# EasyEDA Pro project ESP32-S3-WROOM-1 Breakout.epro

# Schematic ESP32-S3 DevBoard
Board Name: DevBoard; Create Date: 2026-04-19; Page Name: ESP32-S3-WROOM-1; Project Name: ESP32-S3-WROOM-1 Breakout; Schematic Name: ESP32-S3 DevBoard; Update Date: 2026-04-19; Company: EasyEDA.com; Page Size: A4; Version: V1.0
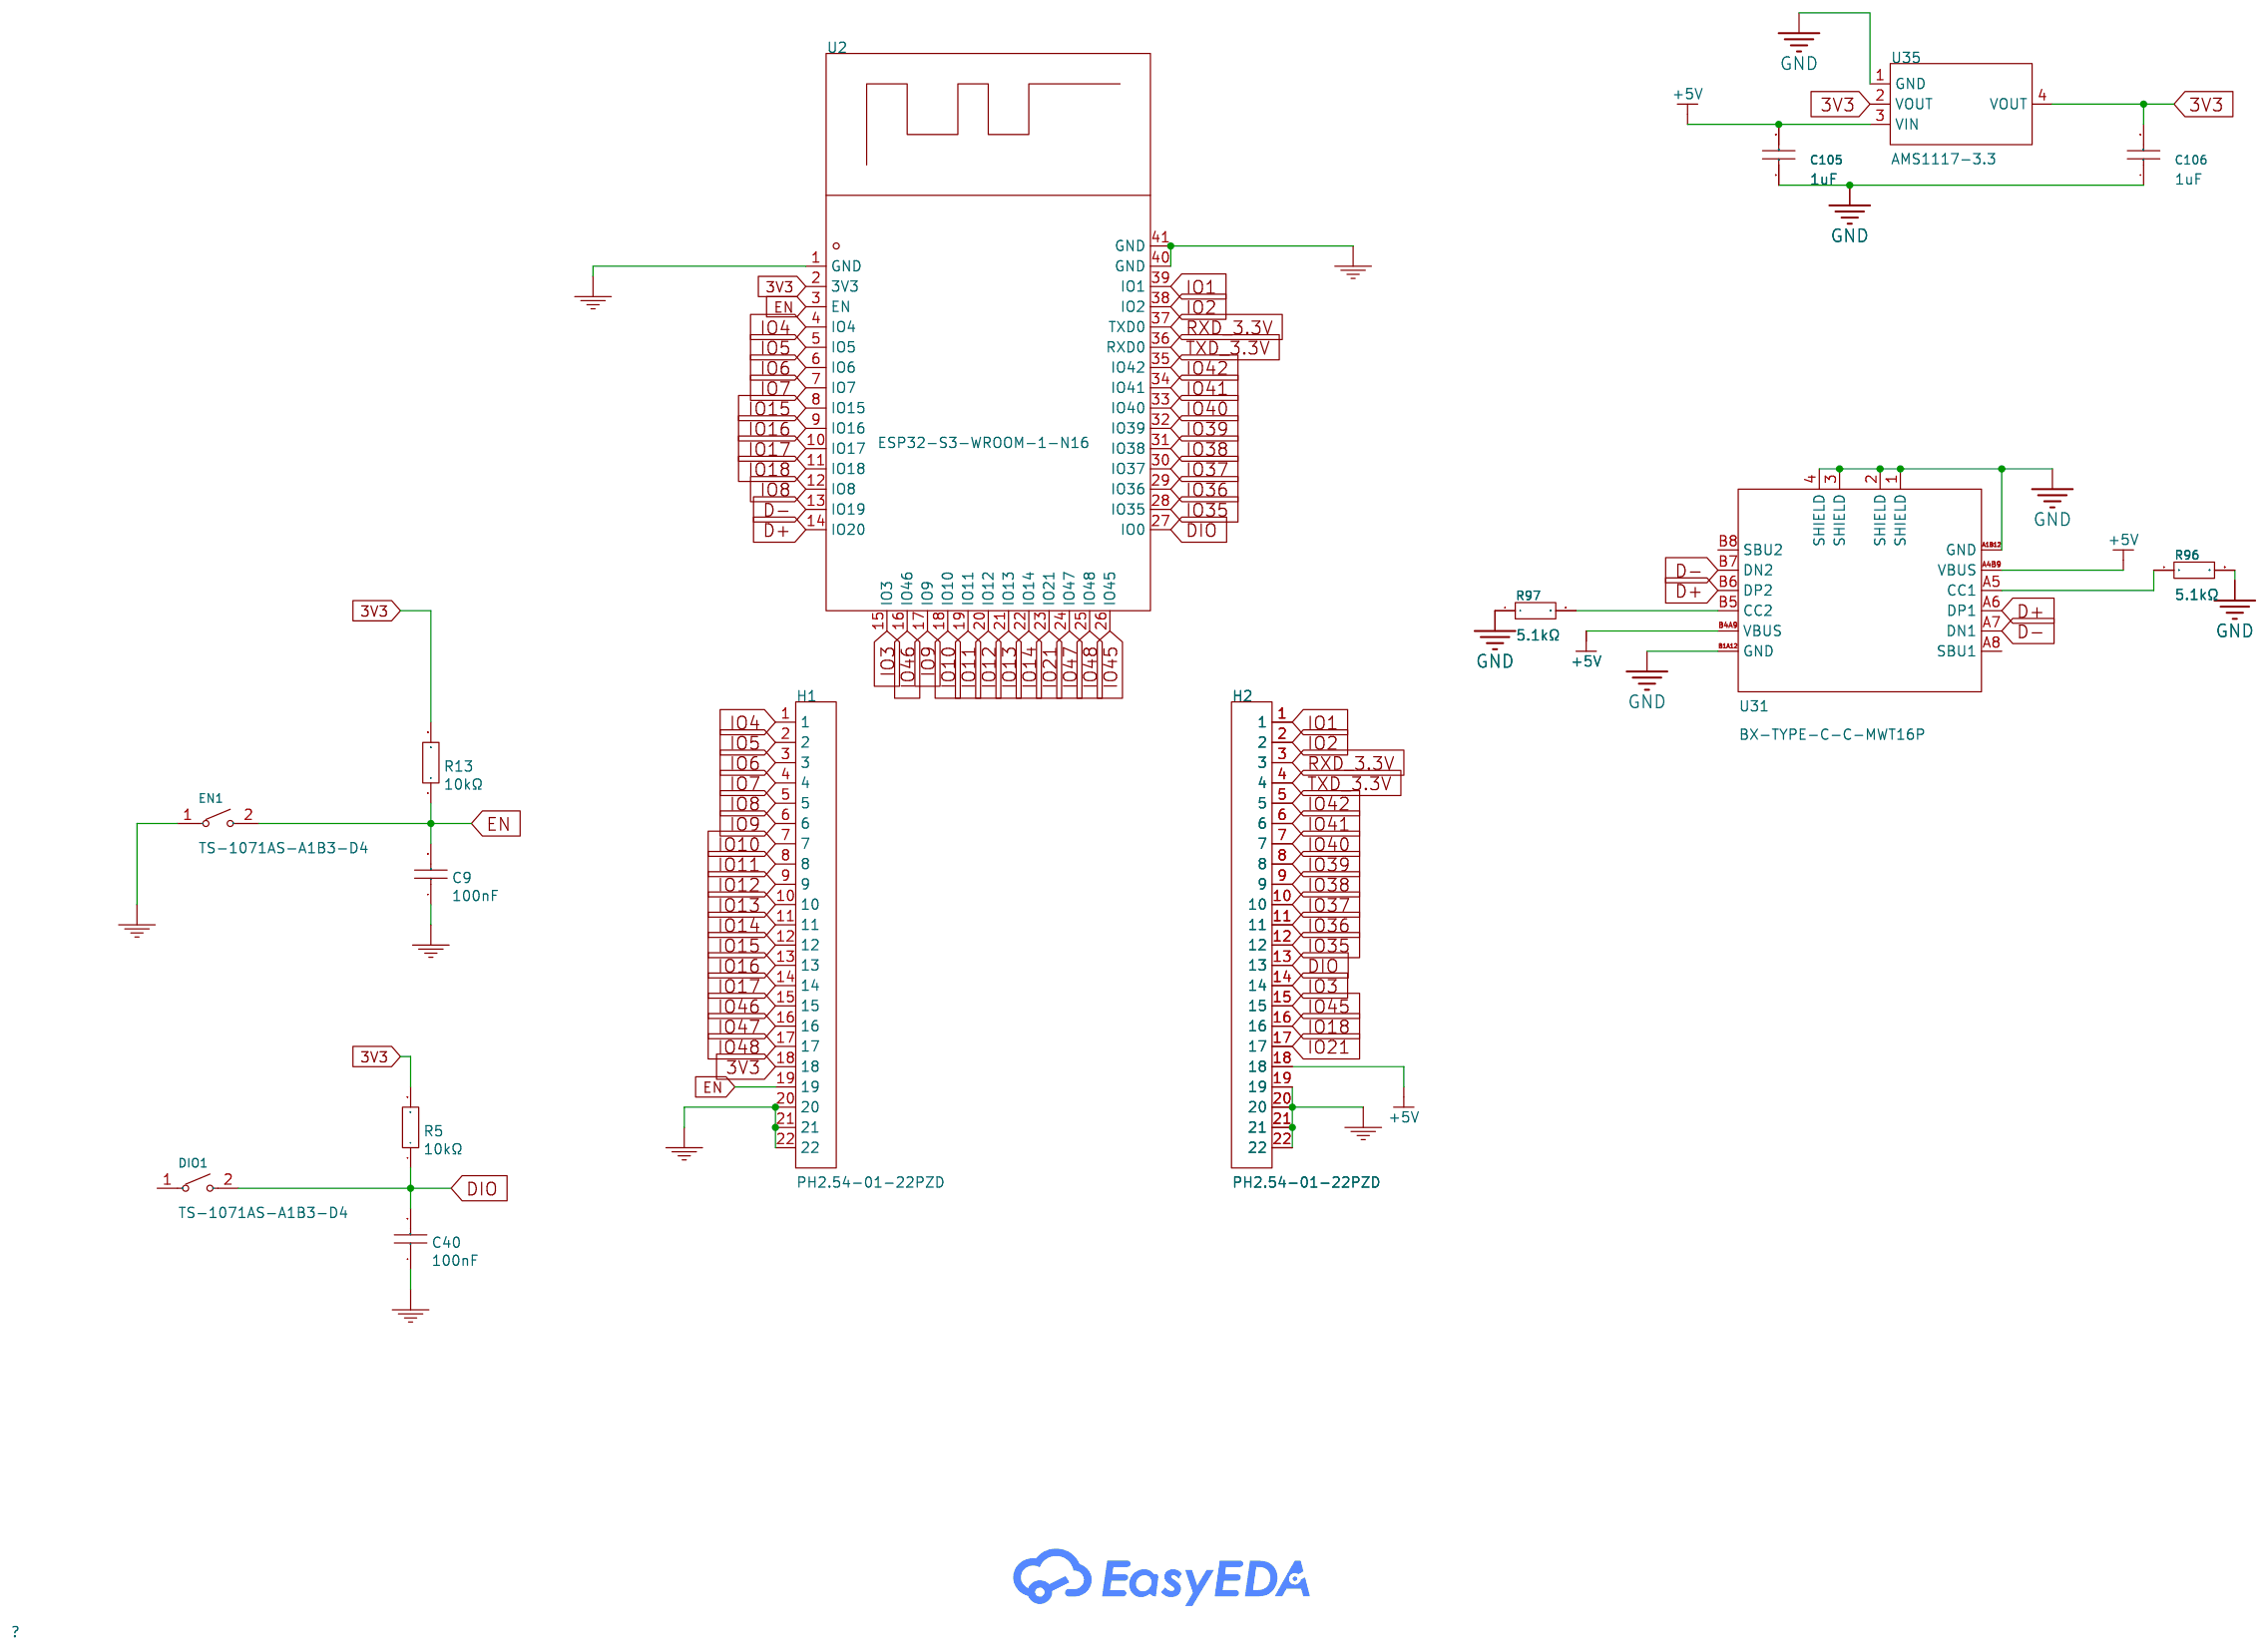
[diagram p0: schematic sheet]

## Parts
C9  100nF  [C0402_NEW]
C40  100nF  [C0402_NEW]
C105  1uF  [C0402]
C106  1uF  [C0402]
DIO1  TS-1071AS-A1B3-D4  [SW-SMD_L4.0-W3.0-LS4.8]
EN1  TS-1071AS-A1B3-D4  [SW-SMD_L4.0-W3.0-LS4.8]
H1  PH2.54-01-22PZD  [HDR-TH_PH2.54-01-22PZD]
H2  PH2.54-01-22PZD  [HDR-TH_PH2.54-01-22PZD]
R5  10kΩ  [R0402]
R13  10kΩ  [R0402]
R96  5.1kΩ  [R0402]
R97  5.1kΩ  [R0402]
U2  ESP32-S3-WROOM-1-N16  [WIRELM-SMD_ESP32-S3-WROOM-1]
U31  BX-TYPE-C-C-MWT16P  [USB-C-SMD_BX-TYPE-C-C-MWT16P]
U35  AMS1117-3.3  [SOT-223-3_L6.5-W3.4-P2.30-LS7.0-BR]

## Library data of the parts
C9 C40 = 100nF: Supplier: LCSC; Manufacturer Part: CL05B104KO5NNNC; Manufacturer: SAMSUNG; Supplier Part: C1525; JLCPCB Part Class: Basic Part
C105 C106 = CL05A105KP5NNNC: Capacitance: Tolerance:±10% Tolerance:±10% Voltage Rated: Temperature Coefficient:; LCSC Part Name: 1uF ±10% 10V; Supplier Part: C14445; Manufacturer: SAMSUNG(三星); Supplier Footprint: 0402; JLCPCB Part Class: Extended Part; Datasheet: https://atta.szlcsc.com/upload/public/pdf/source/20160218/1457707763339.pdf; Supplier: LCSC; Tolerance: ±10%
DIO1 EN1 = TS-1071AS-A1B3-D4: Circuit:SPST Actuator Style:Round Button Operating Force:250gf Mounting Style:Brick nogging Switch Length:4mm Switch Width:3mm Switch Height:2mm Actuator/Cap Color:Blue Pin Style:SMDSplicing Mechanical Life:-; LCSC Part Name: 4*3*2mm 立贴 轻触开关; Supplier Part: C492861; Manufacturer: Yuandi(元迪); Supplier Footprint: SMD; JLCPCB Part Class: Extended Part; Datasheet: https://atta.szlcsc.com/upload/public/pdf/source/20200427/C492861_8410BFD0129EF5D536AF148AD1D8A09B.pdf; Supplier: LCSC; Circuit: SPST; Actuator Style: Round Button; Operating Force: 250gf; Mounting Style: Brick nogging; Switch Length: 4mm; Switch Width: 3mm; Switch Height: 2mm; Actuator/Cap Color: Blue; Pin Style: SMDSplicing
H1 H2 = PH2.54-01-22PZD: Pin Structure:1x22P Pitch:2.54mm Circluar Pins/Square Pins:Pin Header Mounting Type:Through Hole Number of Rows:1 Number of Pins:22P Current Rating:3A Length of Mating Pin:6mm Insulation Height:2.5mm Contact Material:Brass Operating Temperature:-40℃~+105℃; LCSC Part Name: 1x22P 间距:2.54mm 方针 直插; Supplier Part: C53433113; Manufacturer: XUNPU(讯普); Supplier Footprint: 插件,P=2.54mm; JLCPCB Part Class: Extended Part; Datasheet: https://item.szlcsc.com/datasheet/PH2.54-01-22PZD/56574276.html; Supplier: LCSC; Pin Structure: 1x22P; Pitch: 2.54mm; Circluar Pins/Square Pins: Pin Header; Mounting Type: Through Hole; Number of Rows: 1; Number of Pins: 22P; Current Rating: 3A; Length of Mating Pin: 6mm; Insulation Height: 2.5mm; Contact Material: Brass; Operating Temperature: -40℃~+105℃
R5 R13 = 10kΩ: Supplier: LCSC; Manufacturer: UniOhm; Manufacturer Part: 0402WGF1002TCE; Supplier Part: C25744; Resistance: 10K; JLCPCB Part Class: Basic Part
R96 R97 = 0402WGF5101TCE: Type:Thick Film Resistor Resistance:5.1kΩ Tolerance:±1% Tolerance:±1% Power(Watts):62.5mW Voltage-Supply(Max):50V Temperature Coefficient:±100ppm/℃ Temperature Coefficient:±100ppm/℃ Operating Temperature:-55℃~+155℃ Operating Temperature:-55℃~+155℃; LCSC Part Name: 5.1kΩ ±1% 62.5mW 厚膜电阻; Supplier Part: C25905; Manufacturer: UNI-ROYAL(厚声); Supplier Footprint: 0402; Datasheet: https://item.szlcsc.com/datasheet/0402WGF5101TCE/26648.html; Supplier: LCSC; Type: Thick Film Resistor; Tolerance: ±1%; Power(Watts): 62.5mW; Voltage-Supply(Max): 50V; Temperature Coefficient: ±100ppm/℃; Operating Temperature: -55℃~+155℃
U2 = ESP32-S3-WROOM-1-N16: LCSC Part Name: 通用型Wi-Fi+低功耗蓝牙MCU模组; Supplier Part: C2913199; Manufacturer: ESPRESSIF(乐鑫); Supplier Footprint: SMD,18x25.5mm; JLCPCB Part Class: Extended Part; Datasheet: https://atta.szlcsc.com/upload/public/pdf/source/20241030/6A412B13087E1327DF6279F5735253CA.pdf; Supplier: LCSC
U31 = BX-TYPE-C-C-MWT16P: Connector Type:Type-C Standard:USB 3.1 Gender:Mother Mounting Style:Horizontal attachment Number of Contacts:16P Number of Ports:1 Current Rating - Power (Max):5A Operating Temperature Range:-45℃~+85℃ Operating Temperature Range:-45℃~+85℃; LCSC Part Name: Type-C 母 卧贴; Supplier Part: C18077665; Manufacturer: Bossie(博锡); Supplier Footprint: SMD; JLCPCB Part Class: Extended Part; Datasheet: https://atta.szlcsc.com/upload/public/pdf/source/20231017/F39B3F898DD8D16D3D2CEE0BEEB24AE0.pdf; Supplier: LCSC; Connector Type: Type-C; Standard: USB 3.1; Gender: Mother; Mounting Style: Horizontal attachment; Number of Contacts: 16P; Number of Ports: 1; Current Rating - Power (Max): 5A; Operating Temperature Range: -45℃~+85℃
U35 = AMS1117-3.3_C6186: Output Type:Fixed Voltage - Supply:16V Output Voltage:3.3V Output Voltage:3.3V Output Current:1A Power Supply Rejection Ratio (PSRR):72dB@(120Hz) Voltage Dropout:1.1V@(800mA) standby current:5mA Noise:0.003%Vout Features:Over Current Protection；Over Tempe; LCSC Part Name: 输出3.3V 1A; Supplier Part: C6186; Manufacturer: AMS; Supplier Footprint: SOT-223; JLCPCB Part Class: Basic Part; Datasheet: https://item.szlcsc.com/datasheet/AMS1117-3.3/6652.html; Supplier: LCSC; Output Type: Fixed; Voltage - Supply: 16V; Output Voltage: 3.3V; Output Current: 1A; Power Supply Rejection Ratio (PSRR): 72dB@(120Hz); Voltage Dropout: 1.1V@(800mA); standby current: 5mA; Noise: 0.003%Vout; Features: Over Current Protection；Over Temperature Protection; Operating Temperature: -40℃~+125℃; Output Configuration: Positive; Number of Outputs: 1

## Nets
3V3: C106.2 H1.18 R5.2 R13.2 U2.2(3V3) U35.2(VOUT) U35.4(VOUT)
+5V: C105.2 H2.18 U31.A4B9(VBUS) U31.B4A9(VBUS) U35.3(VIN)
GND: C9.1 C40.1 C105.1 C106.1 EN1.1 H1.20 H1.21 H1.22 H2.19 H2.20 H2.21 H2.22 R96.2 R97.1 U2.1(GND) U2.40(GND) U2.41(GND) U31.1(SHIELD) U31.2(SHIELD) U31.3(SHIELD) U31.4(SHIELD) U31.A1B12(GND) U31.B1A12(GND) U35.1(GND)
D+: U2.14(IO20) U31.A6(DP1) U31.B6(DP2)
D-: U2.13(IO19) U31.A7(DN1) U31.B7(DN2)
DIO: C40.2 DIO1.2 H2.13 R5.1 U2.27(IO0)
EN: C9.2 EN1.2 H1.19 R13.1 U2.3(EN)
IO1: H2.1 U2.39(IO1)
IO2: H2.2 U2.38(IO2)
IO3: H2.14 U2.15(IO3)
IO4: H1.1 U2.4(IO4)
IO5: H1.2 U2.5(IO5)
IO6: H1.3 U2.6(IO6)
IO7: H1.4 U2.7(IO7)
IO8: H1.5 U2.12(IO8)
IO9: H1.6 U2.17(IO9)
IO10: H1.7 U2.18(IO10)
IO11: H1.8 U2.19(IO11)
IO12: H1.9 U2.20(IO12)
IO13: H1.10 U2.21(IO13)
IO14: H1.11 U2.22(IO14)
IO15: H1.12 U2.8(IO15)
IO16: H1.13 U2.9(IO16)
IO17: H1.14 U2.10(IO17)
IO18: H2.16 U2.11(IO18)
IO21: H2.17 U2.23(IO21)
IO35: H2.12 U2.28(IO35)
IO36: H2.11 U2.29(IO36)
IO37: H2.10 U2.30(IO37)
IO38: H2.9 U2.31(IO38)
IO39: H2.8 U2.32(IO39)
IO40: H2.7 U2.33(IO40)
IO41: H2.6 U2.34(IO41)
IO42: H2.5 U2.35(IO42)
IO45: H2.15 U2.26(IO45)
IO46: H1.15 U2.16(IO46)
IO47: H1.16 U2.24(IO47)
IO48: H1.17 U2.25(IO48)
RXD_3.3V: H2.3 U2.37(TXD0)
TXD_3.3V: H2.4 U2.36(RXD0)
$1N1378: R96.1 U31.A5(CC1)
$1N1381: R97.2 U31.B5(CC2)

Not connected (* = marked no-connect by the designer): DIO1 1; U31 A8(SBU1) B8(SBU2)

# Board ESP32-S3-WROOM-1
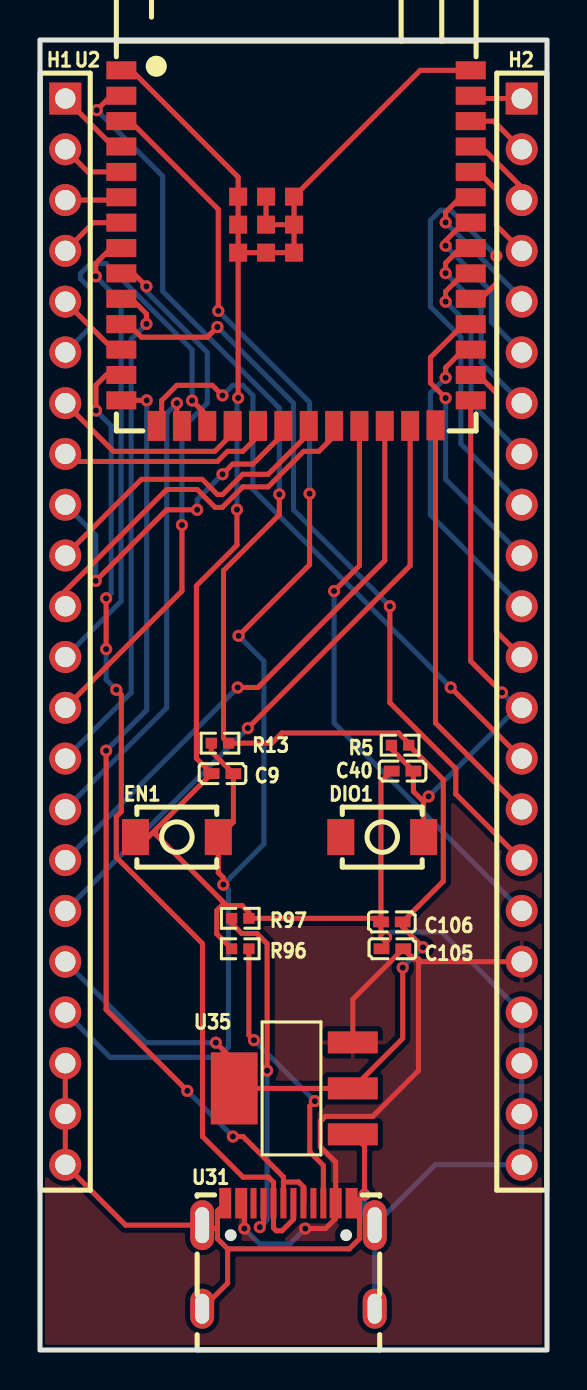
[diagram p1: board, top side]
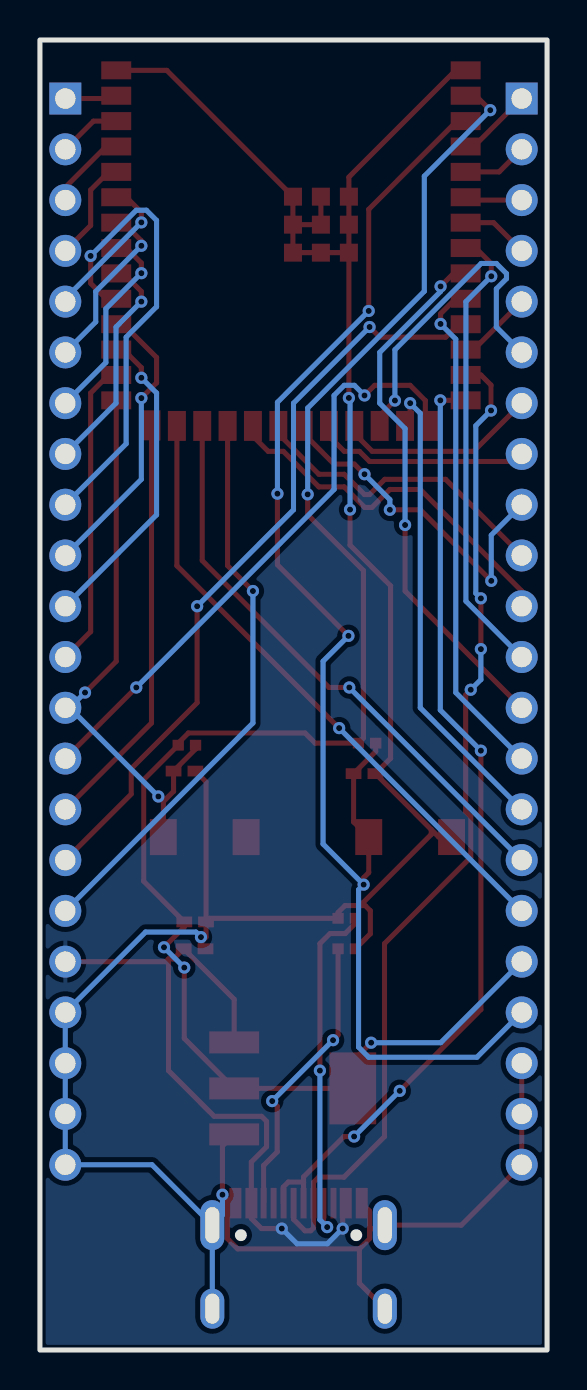
[diagram p2: board, bottom side, seen from below]

Outline 25.4 x 65.54 mm; copper layers: Top Layer, Bottom Layer. Coordinates in mm from the lower left corner of the outline.
Outline path: rectangle 0,65.54 25.4,0
Stack: Top Layer 0.035mm / Dielectric1 1.51mm FR4 er 4.5 / Bottom Layer 0.035mm

## Design rules (mm)
template: JLCPCB Capability(Two Layers Board)
spacing copperThickness1oz (default): track to track 0.102, other pairs 0.152 to 0.3
spacing copperThickness2oz: track to track 0.203, other pairs 0.152 to 0.3
track width copperThickness1oz (default): min 0.127, default 0.254, max 2.54
track width copperThickness2oz: min 0.203, default 0.254, max 2.54
differential pair differentialPair (default): width min 0.127, default 0.254, max 2.54; gap min 0.152, default 0.152
via viaSize (default): diameter min 0.5, default 0.61, max 10; hole min 0.3, default 0.305, max 6.3

## Placement (name value [footprint] x y rotation side)
C9  100nF  [C0402_NEW]  9.14 28.84 0 top
C40  100nF  [C0402_NEW]  18.16 28.96 0 top
C105  1uF  [C0402]  17.65 20.07 0 top
C106  1uF  [C0402]  17.63 21.42 0 top
DIO1  TS-1071AS-A1B3-D4  [SW-SMD_L4.0-W3.0-LS4.8]  17.14 25.66 0 top
EN1  TS-1071AS-A1B3-D4  [SW-SMD_L4.0-W3.0-LS4.8]  6.86 25.66 0 top
H1  PH2.54-01-22PZD  [HDR-TH_PH2.54-01-22PZD]  1.27 35.94 270 top
H2  PH2.54-01-22PZD  [HDR-TH_PH2.54-01-22PZD]  24.13 35.94 270 top
R5  10kΩ  [R0402]  18.04 30.26 0 top
R13  10kΩ  [R0402]  9.02 30.36 0 top
R96  5.1kΩ  [R0402]  10.03 21.6 0 top
R97  5.1kΩ  [R0402]  10.03 20.07 0 top
U2  ESP32-S3-WROOM-1-N16  [WIRELM-SMD_ESP32-S3-WROOM-1]  12.83 55.13 0 top
U31  BX-TYPE-C-C-MWT16P  [USB-C-SMD_BX-TYPE-C-C-MWT16P]  12.45 4.71 0 top
U35  AMS1117-3.3  [SOT-223-3_L6.5-W3.4-P2.30-LS7.0-BR]  12.7 13.09 0 top

## Footprints (pads in the part's own frame, mm; a bottom-side part is the same pattern mirrored in y, then rotated)
C0402
  rect 0.79x0.54 smd: 1(-0.545,0) 2(0.545,0)
C0402_NEW
  rect 0.79x0.54 smd: 1(-0.545,0) 2(0.545,0)
HDR-TH_PH2.54-01-22PZD
  rect 1.6x1.6 hole 1.02: 1(-26.67,0)
  round 1.6 hole 1.02: 2(-24.13,0) 3(-21.59,0) 4(-19.05,0) 5(-16.51,0) 6(-13.97,0) 7(-11.43,0) 8(-8.89,0) 9(-6.35,0) 10(-3.81,0) 11(-1.27,0) 12(1.27,0) 13(3.81,0) 14(6.35,0) 15(8.89,0) 16(11.43,0) 17(13.97,0) 18(16.51,0) 19(19.05,0) 20(21.59,0) 21(24.13,0) 22(26.67,0)
R0402
  rect 0.566x0.54 smd: 1(-0.433,0) 2(0.433,0)
SOT-223-3_L6.5-W3.4-P2.30-LS7.0-BR
  rect 2.5x1.1 smd: 1(2.97,-2.3) 2(2.97,0) 3(2.97,2.3)
  rect 2.34x3.6 smd: 4(-2.97,0)
SW-SMD_L4.0-W3.0-LS4.8
  rect 1.35x1.8 smd: 1(-2.075,0) 2(2.075,0)
USB-C-SMD_BX-TYPE-C-C-MWT16P
  oval 1.2x2.5 hole 0.7x1.8: 1(-4.32,1.54) 3(4.32,1.54)
  oval 1.2x2 hole 0.7x1.5: 2(-4.32,-2.64) 4(4.32,-2.64)
  rect 0.6x1.524 smd: A1B12(-3.165,2.64) A4B9(-2.365,2.64) B1A12(3.165,2.64) B4A9(2.365,2.64)
  rect 0.3x1.524 smd: A5(-1.25,2.64) A6(-0.25,2.64) A7(0.25,2.64) A8(1.25,2.64) B5(1.75,2.64) B6(0.75,2.64) B7(-0.75,2.64) B8(-1.75,2.64)
WIRELM-SMD_ESP32-S3-WROOM-1
  rect 1.5x0.9 smd: 1(-8.75,8.895) 2(-8.75,7.625) 3(-8.75,6.355) 4(-8.75,5.085) 5(-8.75,3.815) 6(-8.75,2.545) 7(-8.75,1.275) 8(-8.75,0.005) 9(-8.75,-1.265) 10(-8.75,-2.535) 11(-8.75,-3.805) 12(-8.75,-5.075) 13(-8.75,-6.345) 14(-8.75,-7.615) 27(8.75,-7.615) 28(8.75,-6.345) 29(8.75,-5.075) 30(8.75,-3.805) 31(8.75,-2.535) 32(8.75,-1.265) 33(8.75,0.005) 34(8.75,1.275) 35(8.75,2.545) 36(8.75,3.815) 37(8.75,5.085) 38(8.75,6.355) 39(8.75,7.625) 40(8.75,8.895)
  rect 0.9x1.5 smd: 15(-6.985,-8.895) 16(-5.715,-8.895) 17(-4.445,-8.895) 18(-3.175,-8.895) 19(-1.905,-8.895) 20(-0.635,-8.895) 21(0.635,-8.895) 22(1.905,-8.895) 23(3.175,-8.895) 24(4.445,-8.895) 25(5.715,-8.895) 26(6.985,-8.865)
  rect 0.9x0.9 smd: 41(-2.9,2.575) 41(-2.9,1.175) 41(-2.9,-0.225) 41(-1.5,2.575) 41(-1.5,1.175) 41(-1.5,-0.225) 41(-0.1,2.575) 41(-0.1,1.175) 41(-0.1,-0.225)

## Nets
As in the schematic.

Pads without a net: DIO1 1; U31 A8 B8

## Via types
v1: diameter 0.61, hole 0.305, Top Layer to Bottom Layer, 52 vias

## Routing (per net, layer and track width the routed paths; a pad name or vN(x,y) marks a point on that pad's centre or on a via; arc(x,y) is an arc through that point)
3V3: length 86.3
  Top Layer w0.254: 9.83,13.09 U35.2 18.17,15.59 v1(18.17,19.13) ; 9.83,13.09 U35.4 ; 9.83,13.09 9.83,14.36 v1(8.81,15.38) ; U2.2 3.57,62.75 v1(2.85,62.03) ; v1(11.99,42.81) 11.99,41.79 9.2,39 9.2,30.61 R13.2 11.61,30.36 12.12,30.87 17.96,30.87 18.47,30.36 18.47,30.26 20.2,28.53 20.2,23.45 C106.2 18.17,21.16 v1(19.19,20.15)
  Bottom Layer w0.254: v1(11.99,42.81) 11.99,47.12 6.15,52.97 6.15,58.73 v1(2.85,62.03) ; v1(8.81,15.38) 5.32,15.38 H1.18 ; v1(19.19,20.15) v1(18.17,19.13)
+5V: length 35.4
  Top Layer w0.254: 18.96,19.57 18.71,19.57 C105.2 15.67,17.55 U35.3 ; 18.96,19.57 19.1,19.43 H2.18 ; 18.96,19.57 18.96,13.98 16.67,11.69 14.3,11.69 14.05,11.44 14.05,10.17 14.81,9.41 14.81,6.59 14.3,6.08 v1(13.29,6.08) ; v1(10.24,6.08) 10.24,7.19 U31.A4B9
  Bottom Layer w0.254: v1(13.29,6.08) 12.52,5.31 11,5.31 v1(10.24,6.08)
GND: length 153.8
  Top Layer w0.254: U2.40 19.05,64.02 12.73,57.7 12.73,56.3 ; C106.1 16.9,21.6 R96.2 10.47,21.89 10.12,22.23 9.36,22.23 ; C106.1 17.08,20.66 17.33,20.4 ; C106.1 17.08,28.43 C40.1 ; 12.73,56.3 12.73,54.9 U2.41 U2.41 ; 12.73,56.3 U2.41 U2.41 ; 17.33,20.4 v1(17.33,20.66) ; 17.33,20.4 17.33,20.3 C105.1 ; U2.41 U2.41 U2.41 9.93,58.68 4.59,64.01 4.08,64.01 U2.1 ; U2.41 v1(9.93,47.63) ; 5.8,26.04 C9.1 7.84,29.6 7.84,38.23 9.87,40.27 v1(9.87,42.04) ; 5.8,26.04 5.8,25.79 9.36,22.23 ; 5.8,26.04 5.42,25.66 EN1.1 ; 9.36,22.23 9.11,22.23 8.85,21.98 8.85,20.82 R97.1 ; 16,7.52 15.78,7.52 U31.B1A12 ; 16,7.52 16,5.57 15.5,5.06 9.4,5.06 ; 16,7.52 v1(16.26,7.77) 16.26,10.2 U35.1 ; 8.89,6.08 8.3,6.08 U31.1 4.29,6.25 1.27,9.27 H1.21 H1.20 ; 8.89,6.08 8.89,5.57 9.4,5.06 ; 8.89,6.08 8.89,6.96 U31.A1B12 ; 9.4,5.06 9.4,3.34 U31.2
  Bottom Layer w0.254: v1(9.93,47.63) 9.87,47.57 v1(9.87,42.04) ; U31.3 16.26,6.75 v1(16.26,7.77) ; U31.3 U31.4 ; U31.3 19.79,9.27 24.13,9.27 H2.21 H2.20 H2.19 20.11,20.91 17.59,20.91 v1(17.33,20.66)
D+: length 48.2
  Top Layer w0.254: 12.2,8.4 12.96,8.4 13.21,8.15 13.21,7.36 U31.B6 ; 12.2,8.4 U31.A6 ; 12.2,8.4 12.2,8.66 10.17,10.68 v1(9.66,10.68) ; v1(3.31,29.98) 3.31,17.03 v1(7.38,12.97) ; U2.14 v1(5.35,47.51)
  Bottom Layer w0.254: v1(5.35,47.51) 5.35,32.02 v1(3.31,29.98) ; v1(7.38,12.97) v1(9.66,10.68)
D-: length 50.6
  Top Layer w0.254: v1(3.82,33.03) 4.08,32.78 4.08,26.94 3.82,26.68 3.82,24.65 8.14,20.33 8.14,10.68 10.17,8.65 11.44,8.65 11.7,8.39 11.7,7.38 ; 11.7,7.38 U31.B7 ; 11.7,7.38 11.7,6.11 11.84,5.97 12.13,5.97 12.7,6.54 U31.A7 ; v1(3.31,37.6) v1(3.31,35.06) ; v1(2.81,47) 2.81,48.27 3.31,48.78 U2.13
  Bottom Layer w0.254: v1(3.31,35.06) 3.31,33.54 v1(3.82,33.03) ; v1(2.81,47) 3.57,46.24 3.57,37.86 v1(3.31,37.6)
DIO: length 28.5
  Top Layer w0.254: 19.21,27.44 18.71,27.95 C40.2 17.61,30.06 R5.1 ; 19.21,27.44 19.21,25.67 ; 19.21,27.44 v1(19.47,27.69) ; U2.27 21.58,34.46 v1(23.14,32.89)
  Bottom Layer w0.254: v1(19.47,27.69) 23.9,32.13 ; 23.9,32.13 v1(23.14,32.89) ; 23.9,32.13 H2.13
EN: length 70.7
  Top Layer w0.254: v1(8.93,51.98) 8.93,57.06 4.61,61.38 4.17,61.38 U2.3 ; v1(13.5,42.84) 13.5,39.28 v1(9.95,35.73) ; v1(9.19,23.28) 9.19,23.63 8.93,23.88 8.93,25.66 9.69,26.42 9.69,28.84 8.58,29.94 R13.1
  Bottom Layer w0.254: v1(8.93,51.98) 13.5,47.41 v1(13.5,42.84) ; H1.19 3.51,14.65 8.93,14.65 9.44,15.15 9.44,23.03 v1(9.19,23.28) 11.22,25.31 11.22,34.46 v1(9.95,35.73)
IO1: length 2.6
  Top Layer w0.254: H2.1 21.72,62.61 U2.39
IO2: length 3.1
  Top Layer w0.254: U2.38 22.72,61.48 H2.2
IO3: length 30.6
  Top Layer w0.254: 24.13,29.59 v1(20.57,33.15) ; U2.15 6.1,46.48 6.1,47.5 6.86,48.26 8.64,48.26 v1(9.14,47.75)
  Bottom Layer w0.254: v1(20.57,33.15) 10.67,43.05 10.67,47.75 10.16,48.26 9.65,48.26 v1(9.14,47.75)
IO4: length 3.8
  Top Layer w0.254: U2.4 3.67,60.21 H1.1
IO5: length 3.3
  Top Layer w0.254: U2.5 2.4,58.94 H1.2
IO6: length 2.9
  Top Layer w0.254: H1.3 3.94,57.53 U2.6
IO7: length 3.4
  Top Layer w0.254: H1.4 2.68,56.4 U2.7
IO8: length 3.8
  Top Layer w0.254: U2.12 3.67,50.05 1.27,52.45
IO9: length 16.4
  Top Layer w0.254: U2.17 8.38,46.74 v1(7.62,47.5)
  Bottom Layer w0.254: H1.6 2.54,51.18 2.54,53.09 2.03,53.6 2.03,53.85 2.54,54.36 3.3,54.36 7.62,50.04 v1(7.62,47.5)
IO10: length 10.1
  Top Layer w0.254: 1.27,47.37 3.68,44.96 8.76,44.96 9.65,45.85 U2.18
IO11: length 10.8
  Top Layer w0.254: H1.8 1.65,44.45 8.89,44.45 9.4,44.96 10.16,44.96 10.92,45.72 U2.19
IO12: length 17.6
  Top Layer w0.254: v1(9.14,43.81) 9.65,44.32 10.67,44.32 12.19,45.85 U2.20 ; v1(7.87,42.04) 6.35,42.04 v1(2.79,38.48)
  Bottom Layer w0.254: v1(2.79,38.48) 2.79,40.77 H1.9 ; v1(9.14,43.81) 7.87,42.54 v1(7.87,42.04)
IO13: length 15.7
  Top Layer w0.254: H1.10 5.08,43.56 8.13,43.56 8.89,42.8 9.14,42.8 10.16,43.81 11.43,43.81 13.46,45.85 U2.21
IO14: length 18.7
  Top Layer w0.254: U2.22 14.73,45.72 13.97,44.96 13.21,44.96 11.43,43.18 10.16,43.18 9.13,42.15 8.77,42.15 7.87,43.05 6.35,43.05 1.27,37.97 H1.11
IO15: length 23
  Top Layer w0.254: v1(2.79,53.72) 2.79,54.36 3.56,55.12 4.06,55.12 U2.8
  Bottom Layer w0.254: 1.27,34.67 4.06,37.46 4.06,52.45 v1(2.79,53.72)
IO16: length 26.8
  Top Layer w0.254: v1(7.11,41.27) 7.11,37.97 H1.13 ; v1(5.33,53.21) 4.68,53.86 U2.9
  Bottom Layer w0.254: v1(5.33,53.21) 5.33,52.96 8.38,49.91 8.38,47.37 7.11,46.1 v1(7.11,41.27)
IO17: length 25.5
  Top Layer w0.254: U2.10 4.09,52.6 4.57,52.6 5.33,51.84 v1(5.33,51.33)
  Bottom Layer w0.254: 1.27,29.59 4.57,32.89 4.57,50.57 v1(5.33,51.33)
IO18: length 38.3
  Top Layer w0.254: v1(8.89,51.18) 8.38,50.67 5.08,50.67 4.43,51.32 U2.11 ; v1(17.53,37.21) 17.53,32.38 20.83,29.08 20.83,27.81 H2.16
  Bottom Layer w0.254: v1(8.89,51.18) 12.7,47.37 12.7,42.04 v1(17.53,37.21)
IO21: length 28.7
  Top Layer w0.254: v1(14.73,37.97) 16,39.24 U2.23
  Bottom Layer w0.254: H2.17 14.73,31.37 v1(14.73,37.97)
IO35: length 15.4
  Top Layer w0.254: U2.28 21.96,48.78 22.86,47.88 22.86,35.94 24.13,34.67
IO36: length 15.8
  Top Layer w0.254: v1(20.32,48.64) 20.32,49.15 21.22,50.05 U2.29
  Bottom Layer w0.254: H2.11 19.56,41.78 19.56,47.88 v1(20.32,48.64)
IO37: length 14.5
  Top Layer w0.254: v1(20.32,47.62) 19.56,48.39 19.56,49.66 21.22,51.32 U2.30
  Bottom Layer w0.254: H2.10 20.32,43.56 v1(20.32,47.62)
IO38: length 23.6
  Top Layer w0.254: v1(22.86,54.74) 22.86,53.37 22.1,52.6 21.59,52.6 U2.31
  Bottom Layer w0.254: H2.9 21.08,45.34 21.08,50.67 19.56,52.2 19.56,56.51 20.07,57.02 20.57,57.02 v1(22.86,54.74)
IO39: length 11.3
  Top Layer w0.254: v1(20.32,52.45) 20.32,52.96 21.22,53.86 U2.32
  Bottom Layer w0.254: H2.8 21.59,47.37 21.59,51.18 v1(20.32,52.45)
IO40: length 10.2
  Top Layer w0.254: U2.33 21.07,55.13 20.32,54.38 v1(20.32,53.87)
  Bottom Layer w0.254: 24.13,47.37 22.1,49.4 22.1,52.1 v1(20.32,53.87)
IO41: length 8.8
  Top Layer w0.254: U2.34 21.22,56.4 20.32,55.5 v1(20.32,55.24)
  Bottom Layer w0.254: v1(20.32,55.24) 22.61,52.96 22.61,51.43 H2.6
IO42: length 7.6
  Top Layer w0.254: v1(20.32,56.41) 20.32,56.92 21.08,57.68 21.56,57.68 U2.35
  Bottom Layer w0.254: v1(20.32,56.41) 24.13,52.6 24.13,52.45
IO45: length 21
  Top Layer w0.254: H2.15 19.81,31.37 U2.26
IO46: length 23.9
  Top Layer w0.254: v1(6.86,47.37) 6.86,46.48 U2.16
  Bottom Layer w0.254: v1(6.86,47.37) 6.35,46.86 6.35,32.13 H1.15
IO47: length 28.9
  Top Layer w0.254: U2.24 17.27,39.5 10.92,33.15 v1(9.91,33.15)
  Bottom Layer w0.254: H1.16 v1(9.91,33.15)
IO48: length 31.4
  Top Layer w0.254: v1(10.41,31.11) 18.54,39.24 U2.25
  Bottom Layer w0.254: H1.17 v1(10.41,31.11)
RXD_3.3V: length 4
  Top Layer w0.254: H2.3 24.13,58.17 22.1,60.2 21.59,60.2 U2.37
TXD_3.3V: length 5.2
  Top Layer w0.254: H2.4 22.86,56.26 22.86,58.04 21.96,58.94 U2.36
$1N1378: length 18.1
  Top Layer w0.254: v1(11.01,6.15) 11.2,6.33 U31.A5 ; v1(11.38,13.98) 11.38,20.33 10.87,20.84 10.11,20.84 9.6,21.34 R96.1
  Bottom Layer w0.254: v1(11.38,13.98) 11.38,6.51 v1(11.01,6.15)
$1N1381: length 14.5
  Top Layer w0.254: v1(13.77,12.45) 13.51,12.2 13.51,9.91 14.2,9.23 U31.B5 ; R97.2 10.47,15.76 v1(10.72,15.5)
  Bottom Layer w0.254: v1(10.72,15.5) v1(13.77,12.45)

## Copper pours and planes (outline as drawn; the poured copper is in the pictures)
+5V on Top Layer: 0,65.54 25.4,65.54 25.4,0 0,0
+5V on Bottom Layer: 0,65.54 25.11,65.54 25.11,0 0,0
